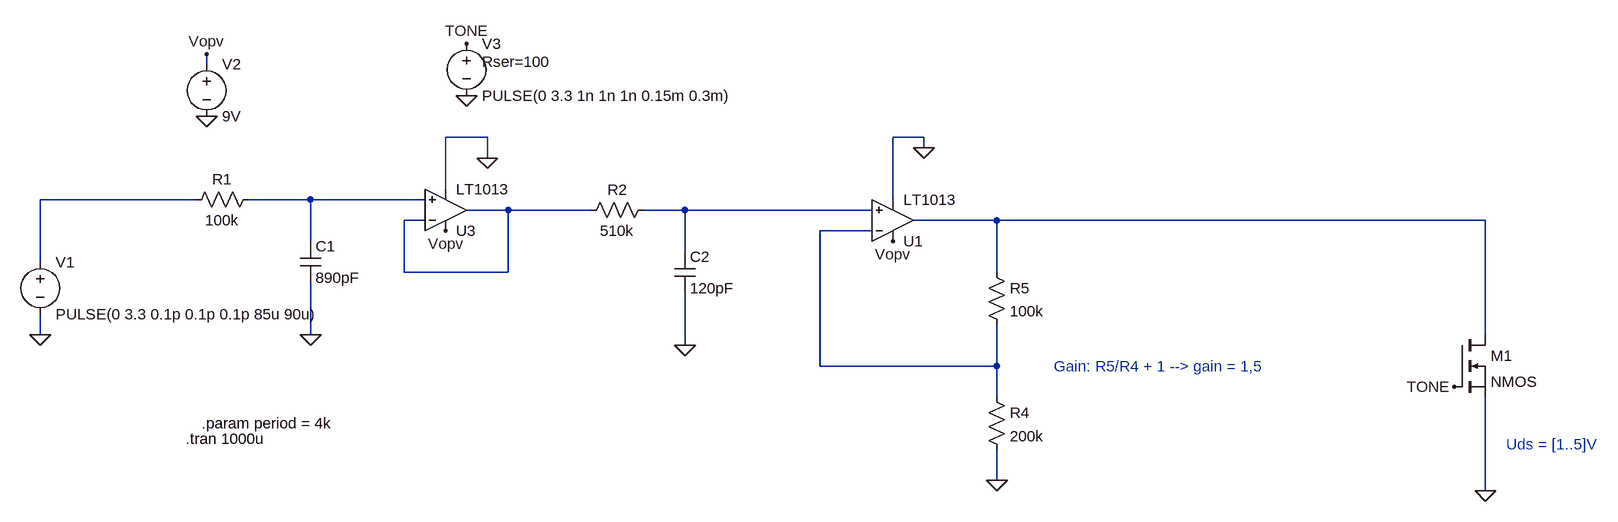
[diagram p0: schematic __smoothingSD_DAC_.asc]
__smoothingSD_DAC_.asc, the LTspice schematic file:
Version 4
SHEET 1 3364 680
WIRE -32 -128 -32 -144
WIRE 400 -16 336 -16
WIRE 1072 -16 1024 -16
WIRE 1072 0 1072 -16
WIRE 400 16 400 -16
WIRE 336 64 336 -16
WIRE -48 80 -288 80
WIRE 128 80 32 80
WIRE 304 80 128 80
WIRE 1024 80 1024 -16
WIRE 432 96 368 96
WIRE 560 96 432 96
WIRE 704 96 640 96
WIRE 992 96 704 96
WIRE 304 112 272 112
WIRE 1184 112 1056 112
WIRE 1936 112 1184 112
WIRE 992 128 912 128
WIRE 128 144 128 80
WIRE 704 160 704 96
WIRE -288 176 -288 80
WIRE 272 192 272 112
WIRE 432 192 432 96
WIRE 432 192 272 192
WIRE 1184 192 1184 112
WIRE -288 288 -288 256
WIRE 128 288 128 208
WIRE 1936 288 1936 112
WIRE 704 304 704 224
WIRE 912 336 912 128
WIRE 1184 336 1184 272
WIRE 1184 336 912 336
WIRE 1184 384 1184 336
WIRE 1184 512 1184 464
WIRE 1936 528 1936 384
FLAG 128 288 0
FLAG 704 304 0
FLAG -288 288 0
FLAG 1072 0 0
FLAG -32 -48 0
FLAG -32 -144 Vopv
FLAG 1024 144 Vopv
FLAG 1184 512 0
FLAG 336 128 Vopv
FLAG 400 16 0
FLAG 368 -80 0
FLAG 368 -160 TONE
FLAG 1936 528 0
FLAG 1888 368 TONE
SYMBOL voltage -288 160 R0
WINDOW 123 0 0 Left 0
WINDOW 39 0 0 Left 0
SYMATTR InstName V1
SYMATTR Value PULSE(0 3.3 0.1p 0.1p 0.1p 85u 90u)
SYMBOL res 48 64 R90
WINDOW 0 0 56 VBottom 2
WINDOW 3 32 56 VTop 2
SYMATTR InstName R1
SYMATTR Value 100k
SYMBOL cap 112 144 R0
SYMATTR InstName C1
SYMATTR Value 890pF
SYMBOL res 656 80 R90
WINDOW 0 0 56 VBottom 2
WINDOW 3 32 56 VTop 2
SYMATTR InstName R2
SYMATTR Value 510k
SYMBOL cap 688 160 R0
SYMATTR InstName C2
SYMATTR Value 120pF
SYMBOL OpAmps\\LT1013 1024 176 M180
SYMATTR InstName U1
SYMBOL voltage -32 -144 R0
WINDOW 123 0 0 Left 0
WINDOW 39 24 44 Left 2
SYMATTR InstName V2
SYMATTR Value 9V
SYMBOL res 1168 368 R0
SYMATTR InstName R4
SYMATTR Value 200k
SYMBOL res 1168 176 R0
SYMATTR InstName R5
SYMATTR Value 100k
SYMBOL OpAmps\\LT1013 336 160 M180
SYMATTR InstName U3
SYMBOL voltage 368 -176 R0
WINDOW 123 0 0 Left 0
WINDOW 39 24 44 Left 2
SYMATTR SpiceLine Rser=100
SYMATTR InstName V3
SYMATTR Value PULSE(0 3.3 1n 1n 1n 0.15m 0.3m)
SYMBOL nmos 1888 288 R0
SYMATTR InstName M1
TEXT -40 424 Left 2 !.param period = 4k
TEXT -64 448 Left 2 !.tran 1000u
TEXT 1272 336 Left 2 ;Gain: R5/R4 + 1 --> gain = 1,5
TEXT 1968 456 Left 2 ;Uds = [1..5]V

The netlist it stands for:
* __smoothingSD_DAC_.asc
V1 N001 0 PULSE(0 3.3 0.1p 0.1p 0.1p 85u 90u)
R1 N002 N001 100k
C1 N002 0 890pF
R2 N004 N003 510k
C2 N004 0 120pF
XU1 N004 N006 Vopv 0 N005 LT1013  ; pins In+ In- V+ V- OUT
V2 Vopv 0 9V
R4 N006 0 200k
R5 N005 N006 100k
XU3 N002 N003 Vopv 0 N003 LT1013  ; pins In+ In- V+ V- OUT
V3 TONE 0 PULSE(0 3.3 1n 1n 1n 0.15m 0.3m) Rser=100
M1 N005 TONE 0 0 NMOS
.model NMOS NMOS
.model PMOS PMOS
.lib standard.mos
.param period = 4k
.tran 1000u
* Gain: R5/R4 + 1 --> gain = 1,5
* Uds = [1..5]V
.lib LTC.lib
.backanno
.end